# EAGLE design eeZeeSwitch (EAGLE 6.4)
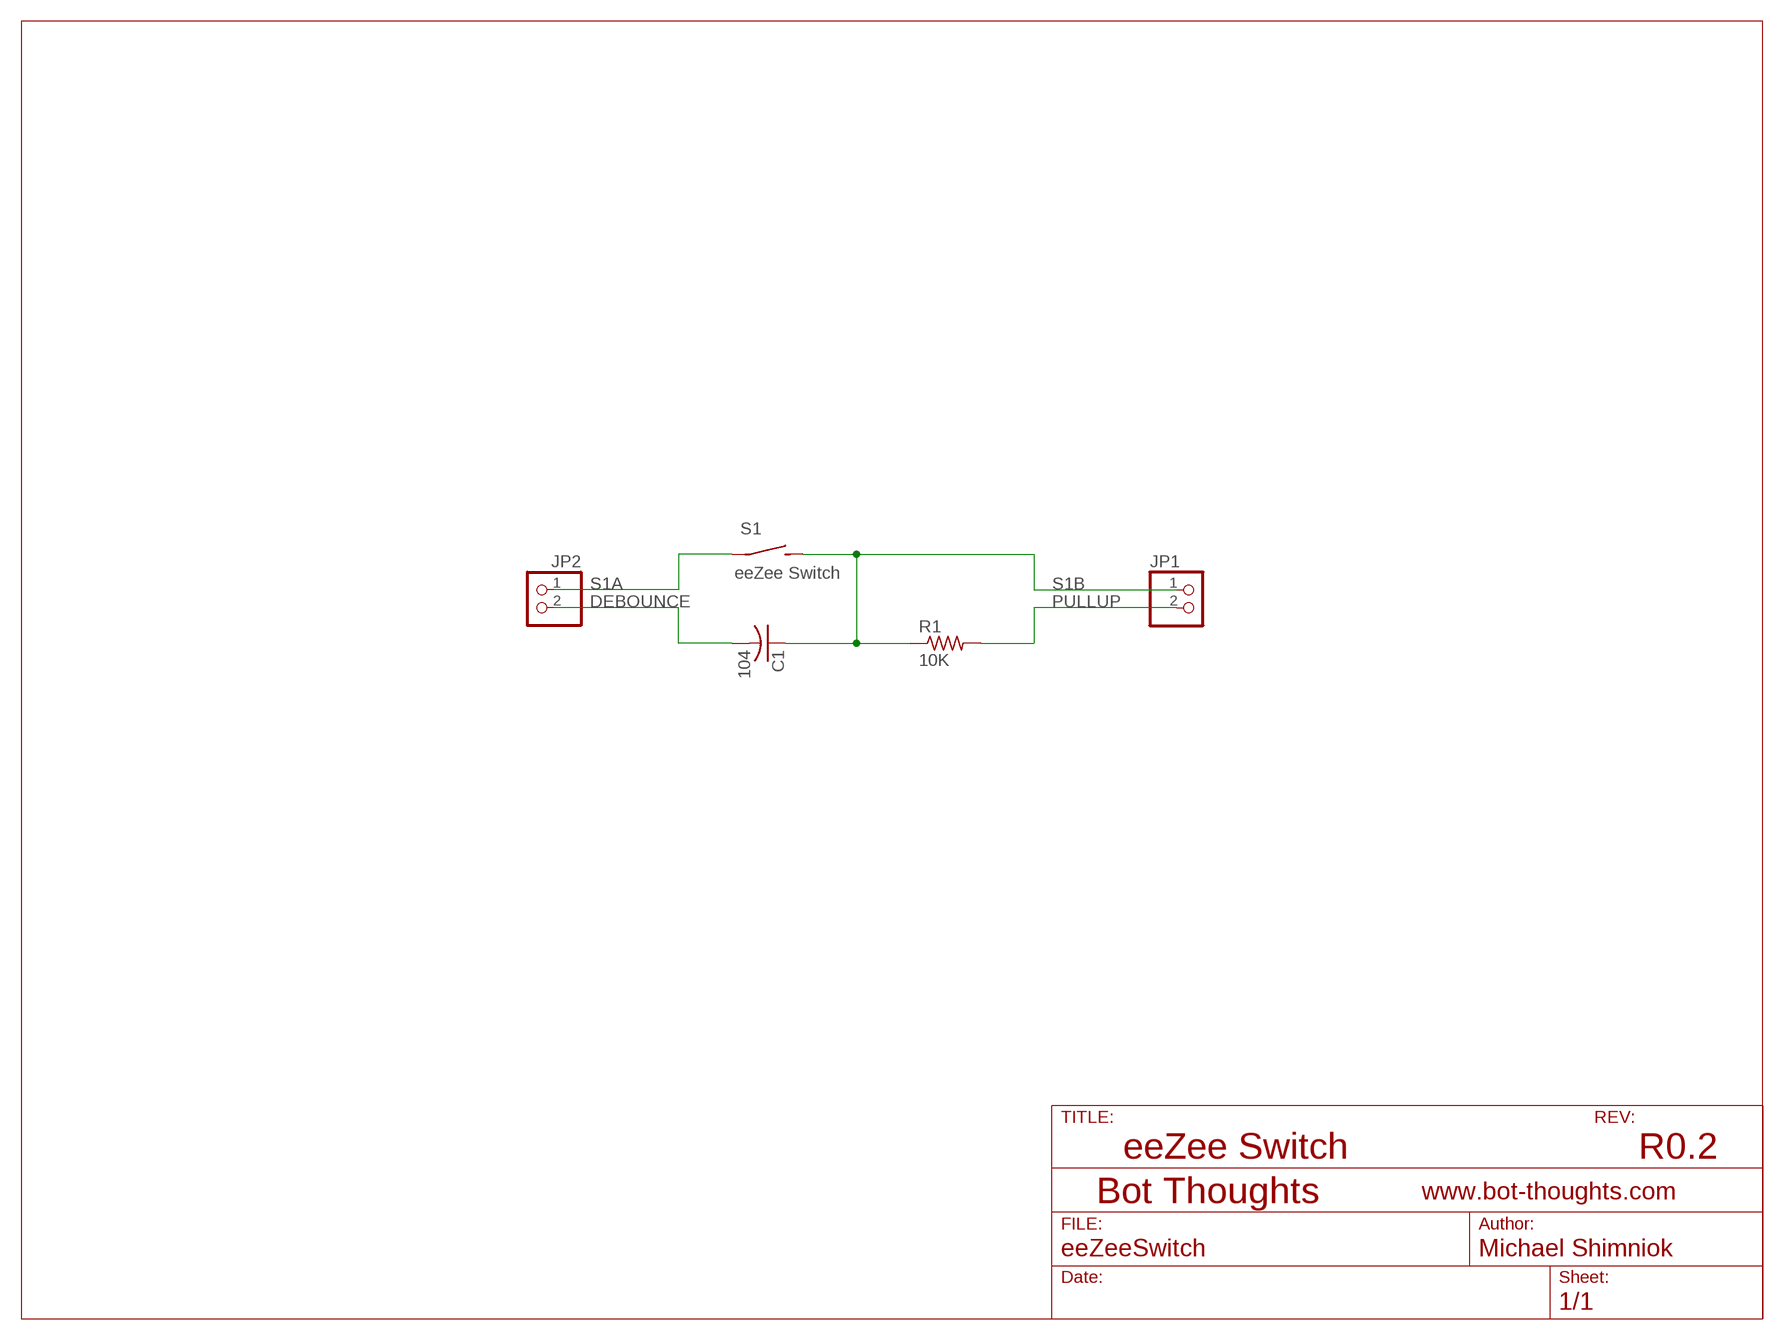
[diagram p0: schematic, sheet 1]

## Parts
C1  104  C-USC0603  [C0603]
JP1  PINHD-1X02_2.54-S  [1X02-S]
JP2  PINHD-1X02_2.54-S  [1X02-S]
R1  10K  R-US_R0603  [R0603]
S1  eeZee Switch  SPST_TAC_RECT1  [6MMTACTILE_RECT]

## Nets
DEBOUNCE: C1.2 JP2.2
PULLUP: JP1.2 R1.2
S1A: JP2.1 S1.P$1(P)
S1B: C1.1 JP1.1 R1.1 S1.P$2(S)

## Notes on the sheet
- eeZee Switch | R0.2

## Library data of the parts
C1 = rcl:C-US: CAPACITOR, American symbol
JP1 JP2 = pinhead-2:PINHD-1X02: PIN HEADER
R1 = rcl:R-US_: RESISTOR, American symbol
S1 = bt_electromech:SPST: SPST SWITCH

## Board
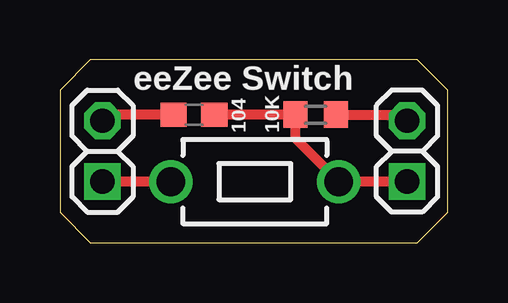
[diagram p1: board, top side]
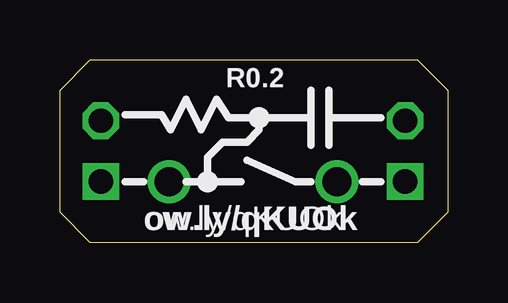
[diagram p2: board, bottom side, seen from below]

Size 16.18 x 7.61 mm. Coordinates in mm from the lower left corner, seen from the top.
Outline: 0,6.34 0,1.27 1.27,0 14.91,0 16.18,1.27 16.18,6.34 14.91,7.61 1.27,7.61 0,6.34
Copper layers (1*16): Top 0.0356mm / dielectric 1.5011mm / Bottom 0.0356mm
Design rules "LaenPCBOrder *": minimum track width 6mil, minimum drill 13mil, track to track 6mil, track to pad 6mil, pad to pad 6mil, via to via 6mil, smd to smd 6mil, copper to edge 10mil, drill to drill 6mil, minimum pad ring 7mil, minimum via ring 7mil, stop-mask expansion 4mil, vias tented up to drill 20mil, thermal gap 10mil

### Footprints (pad centres in the part's own frame; a part is rotated, then mirrored left to right if it is on the bottom)
C0603 = smd 1.1 x 1: 1 -0.85,0; 2 0.85,0
1X02-S = drill 1.016 square: 1 -1.27,0 | drill 1.016 octagon: 2 1.27,0
R0603 = smd 1 x 1.1: 1 -0.85,0; 2 0.85,0
6MMTACTILE_RECT = drill 1.2: P$1 -3.5,0; P$2 3.5,0

### Placement (x,y rotation side)
C1  5.59,5.33 180 top
JP1  14.48,3.81 90 top
JP2  1.78,3.81 90 top
R1  10.67,5.33 0 top
S1  8.13,2.54 0 top

### Tracks (layer width: path | path; a pad name or v marks a point on that pad's centre or on a via)
DEBOUNCE
  Top 0.406: C1.2 2.03,5.33 JP2.2
PULLUP
  Top 0.406: R1.2 14.22,5.33 JP1.2
S1A
  Top 0.406: S1.P$1 JP2.1
S1B
  Top 0.406: JP1.1 S1.P$2 9.82,4.35 R1.1 C1.1

### Text on the board
bPlace: ow.ly/qKUOk
bNames: R0.2
tsilk: eeZee Switch | 104 | 10K
bsilk: R0.2 | ow.ly/qKUOk